# Altium project Standard 60.PrjPcb
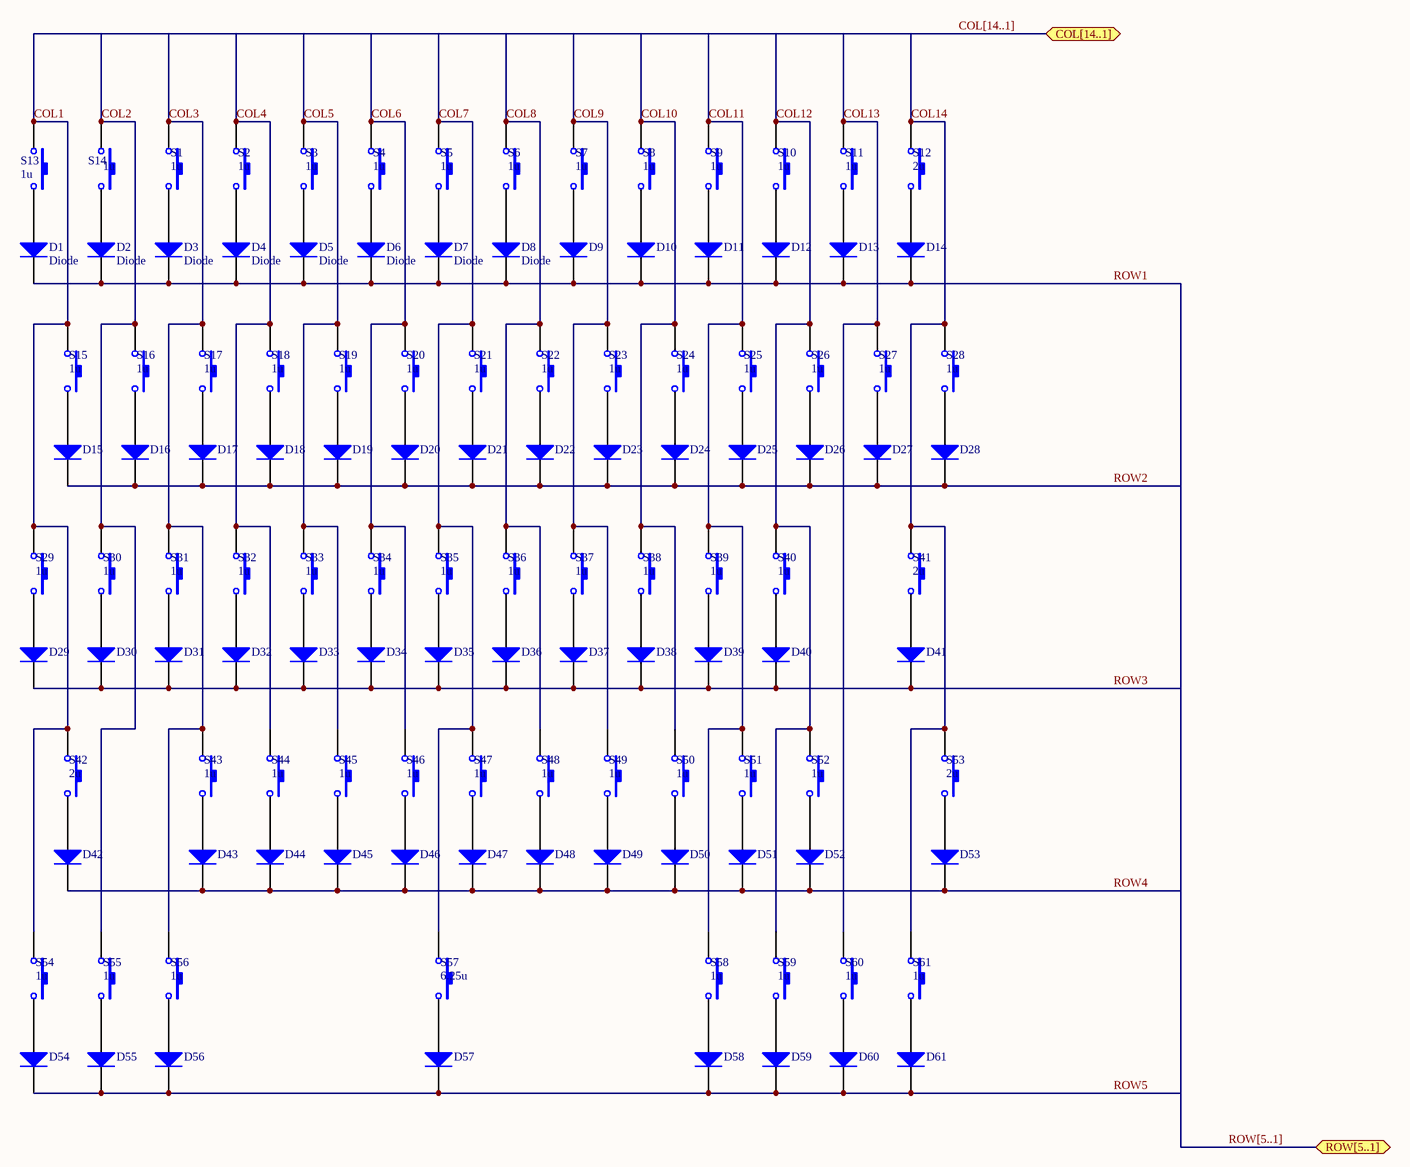
[diagram p0: matrix.SchDoc]
2 sheets, 138 parts. Net scope: flat (ports and power ports of the same name join across sheets).
Board files: Standard 60 03.PcbDoc, Standard 60.PcbDoc, Standard 60 02.PcbDoc
Sheets:
  matrix.SchDoc
  MCU.SchDoc

## Sheet matrix.SchDoc
size A3; SheetNumber: 1; SheetTotal: 2

### Parts
D1  Diode  [SOD-323f]
D2  Diode  [SOD-323f]
D3  Diode  [SOD-323f]
D4  Diode  [SOD-323f]
D5  Diode  [SOD-323f]
D6  Diode  [SOD-323f]
D7  Diode  [SOD-323f]
D8  Diode  [SOD-323f]
D9  Diode  [SOD-323f]  (value not drawn)
D10  Diode  [SOD-323f]  (value not drawn)
D11  Diode  [SOD-323f]  (value not drawn)
D12  Diode  [SOD-323f]  (value not drawn)
D13  Diode  [SOD-323f]  (value not drawn)
D14  Diode  [SOD-323f]  (value not drawn)
D15  Diode  [SOD-323f]  (value not drawn)
D16  Diode  [SOD-323f]  (value not drawn)
D17  Diode  [SOD-323f]  (value not drawn)
D18  Diode  [SOD-323f]  (value not drawn)
D19  Diode  [SOD-323f]  (value not drawn)
D20  Diode  [SOD-323f]  (value not drawn)
D21  Diode  [SOD-323f]  (value not drawn)
D22  Diode  [SOD-323f]  (value not drawn)
D23  Diode  [SOD-323f]  (value not drawn)
D24  Diode  [SOD-323f]  (value not drawn)
D25  Diode  [SOD-323f]  (value not drawn)
D26  Diode  [SOD-323f]  (value not drawn)
D27  Diode  [SOD-323f]  (value not drawn)
D28  Diode  [SOD-323f]  (value not drawn)
D29  Diode  [SOD-323f]  (value not drawn)
D30  Diode  [SOD-323f]  (value not drawn)
D31  Diode  [SOD-323f]  (value not drawn)
D32  Diode  [SOD-323f]  (value not drawn)
D33  Diode  [SOD-323f]  (value not drawn)
D34  Diode  [SOD-323f]  (value not drawn)
D35  Diode  [SOD-323f]  (value not drawn)
D36  Diode  [SOD-323f]  (value not drawn)
D37  Diode  [SOD-323f]  (value not drawn)
D38  Diode  [SOD-323f]  (value not drawn)
D39  Diode  [SOD-323f]  (value not drawn)
D40  Diode  [SOD-323f]  (value not drawn)
D41  Diode  [SOD-323f]  (value not drawn)
D42  Diode  [SOD-323f]  (value not drawn)
D43  Diode  [SOD-323f]  (value not drawn)
D44  Diode  [SOD-323f]  (value not drawn)
D45  Diode  [SOD-323f]  (value not drawn)
D46  Diode  [SOD-323f]  (value not drawn)
D47  Diode  [SOD-323f]  (value not drawn)
D48  Diode  [SOD-323f]  (value not drawn)
D49  Diode  [SOD-323f]  (value not drawn)
D50  Diode  [SOD-323f]  (value not drawn)
D51  Diode  [SOD-323f]  (value not drawn)
D52  Diode  [SOD-323f]  (value not drawn)
D53  Diode  [SOD-323f]  (value not drawn)
D54  Diode  [SOD-323f]  (value not drawn)
D55  Diode  [SOD-323f]  (value not drawn)
D56  Diode  [SOD-323f]  (value not drawn)
D57  Diode  [SOD-323f]  (value not drawn)
D58  Diode  [SOD-323f]  (value not drawn)
D59  Diode  [SOD-323f]  (value not drawn)
D60  Diode  [SOD-323f]  (value not drawn)
D61  Diode  [SOD-323f]  (value not drawn)
S1  1u  [mx1u]
S2  1u  [mx1u]
S3  1u  [mx1u]
S4  1u  [mx1u]
S5  1u  [mx1u]
S6  1u  [mx1u]
S7  1u  [mx1u]
S8  1u  [mx1u]
S9  1u  [mx1u]
S10  1u  [mx1u]
S11  1u  [mx1u]
S12  2u  [mx2u]
S13  1u  [mx1u]
S14  1u  [mx1u]
S15  1u  [mx1u]
S16  1u  [mx1u]
S17  1u  [mx1u]
S18  1u  [mx1u]
S19  1u  [mx1u]
S20  1u  [mx1u]
S21  1u  [mx1u]
S22  1u  [mx1u]
S23  1u  [mx1u]
S24  1u  [mx1u]
S25  1u  [mx1u]
S26  1u  [mx1u]
S27  1u  [mx1u]
S28  1u  [mx1u]
S29  1u  [mx1u]
S30  1u  [mx1u]
S31  1u  [mx1u]
S32  1u  [mx1u]
S33  1u  [mx1u]
S34  1u  [mx1u]
S35  1u  [mx1u]
S36  1u  [mx1u]
S37  1u  [mx1u]
S38  1u  [mx1u]
S39  1u  [mx1u]
S40  1u  [mx1u]
S41  2u  [mx2u]
S42  2u  [mx2u]
S43  1u  [mx1u]
S44  1u  [mx1u]
S45  1u  [mx1u]
S46  1u  [mx1u]
S47  1u  [mx1u]
S48  1u  [mx1u]
S49  1u  [mx1u]
S50  1u  [mx1u]
S51  1u  [mx1u]
S52  1u  [mx1u]
S53  2u  [mx2u]
S54  1u  [mx1u]
S55  1u  [mx1u]
S56  1u  [mx1u]
S57  6.25u  [mx6.25u flipped stab]
S58  1u  [mx1u]
S59  1u  [mx1u]
S60  1u  [mx1u]
S61  1u  [mx1u]

### Ports
COL[14..1] (bidir), ROW[5..1] (bidir)

### Nets
COL1: S13.1 S15.1 S29.1 S42.1 S54.1
COL2: S14.1 S16.1 S30.1 S55.1
COL3: S1.1 S17.1 S31.1 S43.1 S56.1
COL4: S2.1 S18.1 S32.1 S44.1
COL5: S3.1 S19.1 S33.1 S45.1
COL6: S4.1 S20.1 S34.1 S46.1
COL7: S5.1 S21.1 S35.1 S47.1 S57.1
COL8: S6.1 S22.1 S36.1 S48.1
COL9: S7.1 S23.1 S37.1 S49.1
COL10: S8.1 S24.1 S38.1 S50.1
COL11: S9.1 S25.1 S39.1 S51.1 S58.1
COL12: S10.1 S26.1 S40.1 S52.1 S59.1
COL13: S11.1 S27.1 S60.1
COL14: S12.1 S28.1 S41.1 S53.1 S61.1
ROW1: D1.1(K) D2.1(K) D3.1(K) D4.1(K) D5.1(K) D6.1(K) D7.1(K) D8.1(K) D9.1(K) D10.1(K) D11.1(K) D12.1(K) D13.1(K) D14.1(K)
ROW2: D15.1(K) D16.1(K) D17.1(K) D18.1(K) D19.1(K) D20.1(K) D21.1(K) D22.1(K) D23.1(K) D24.1(K) D25.1(K) D26.1(K) D27.1(K) D28.1(K)
ROW3: D29.1(K) D30.1(K) D31.1(K) D32.1(K) D33.1(K) D34.1(K) D35.1(K) D36.1(K) D37.1(K) D38.1(K) D39.1(K) D40.1(K) D41.1(K)
ROW4: D42.1(K) D43.1(K) D44.1(K) D45.1(K) D46.1(K) D47.1(K) D48.1(K) D49.1(K) D50.1(K) D51.1(K) D52.1(K) D53.1(K)
ROW5: D54.1(K) D55.1(K) D56.1(K) D57.1(K) D58.1(K) D59.1(K) D60.1(K) D61.1(K)
NetD1_2: D1.2(A) S13.2
NetD2_2: D2.2(A) S14.2
NetD3_2: D3.2(A) S1.2
NetD4_2: D4.2(A) S2.2
NetD5_2: D5.2(A) S3.2
NetD6_2: D6.2(A) S4.2
NetD7_2: D7.2(A) S5.2
NetD8_2: D8.2(A) S6.2
NetD9_2: D9.2(A) S7.2
NetD10_2: D10.2(A) S8.2
NetD11_2: D11.2(A) S9.2
NetD12_2: D12.2(A) S10.2
NetD13_2: D13.2(A) S11.2
NetD14_2: D14.2(A) S12.2
NetD15_2: D15.2(A) S15.2
NetD16_2: D16.2(A) S16.2
NetD17_2: D17.2(A) S17.2
NetD18_2: D18.2(A) S18.2
NetD19_2: D19.2(A) S19.2
NetD20_2: D20.2(A) S20.2
NetD21_2: D21.2(A) S21.2
NetD22_2: D22.2(A) S22.2
NetD23_2: D23.2(A) S23.2
NetD24_2: D24.2(A) S24.2
NetD25_2: D25.2(A) S25.2
NetD26_2: D26.2(A) S26.2
NetD27_2: D27.2(A) S27.2
NetD28_2: D28.2(A) S28.2
NetD29_2: D29.2(A) S29.2
NetD30_2: D30.2(A) S30.2
NetD31_2: D31.2(A) S31.2
NetD32_2: D32.2(A) S32.2
NetD33_2: D33.2(A) S33.2
NetD34_2: D34.2(A) S34.2
NetD35_2: D35.2(A) S35.2
NetD36_2: D36.2(A) S36.2
NetD37_2: D37.2(A) S37.2
NetD38_2: D38.2(A) S38.2
NetD39_2: D39.2(A) S39.2
NetD40_2: D40.2(A) S40.2
NetD41_2: D41.2(A) S41.2
NetD42_2: D42.2(A) S42.2
NetD43_2: D43.2(A) S43.2
NetD44_2: D44.2(A) S44.2
NetD45_2: D45.2(A) S45.2
NetD46_2: D46.2(A) S46.2
NetD47_2: D47.2(A) S47.2
NetD48_2: D48.2(A) S48.2
NetD49_2: D49.2(A) S49.2
NetD50_2: D50.2(A) S50.2
NetD51_2: D51.2(A) S51.2
NetD52_2: D52.2(A) S52.2
NetD53_2: D53.2(A) S53.2
NetD54_2: D54.2(A) S54.2
NetD55_2: D55.2(A) S55.2
NetD56_2: D56.2(A) S56.2
NetD57_2: D57.2(A) S57.2
NetD58_2: D58.2(A) S58.2
NetD59_2: D59.2(A) S59.2
NetD60_2: D60.2(A) S60.2
NetD61_2: D61.2(A) S61.2

### Buses and harness runs
bus COL[14..1] = port COL[14..1]
bus ROW[5..1] = port ROW[5..1]

### Library data of the parts
S1-S11 S13-S40 S43-S52 S54-S56 S58-S61 = 1u: 1-2u Mx Switch
S12 S41 S42 S53 = 2u: 2-3u Mx Switch with pcb mount stabs
S57 = 6.25u: 6.25u Mx Switch with pcb mount stabs

## Sheet MCU.SchDoc
size A4; SheetNumber: 2; SheetTotal: 2
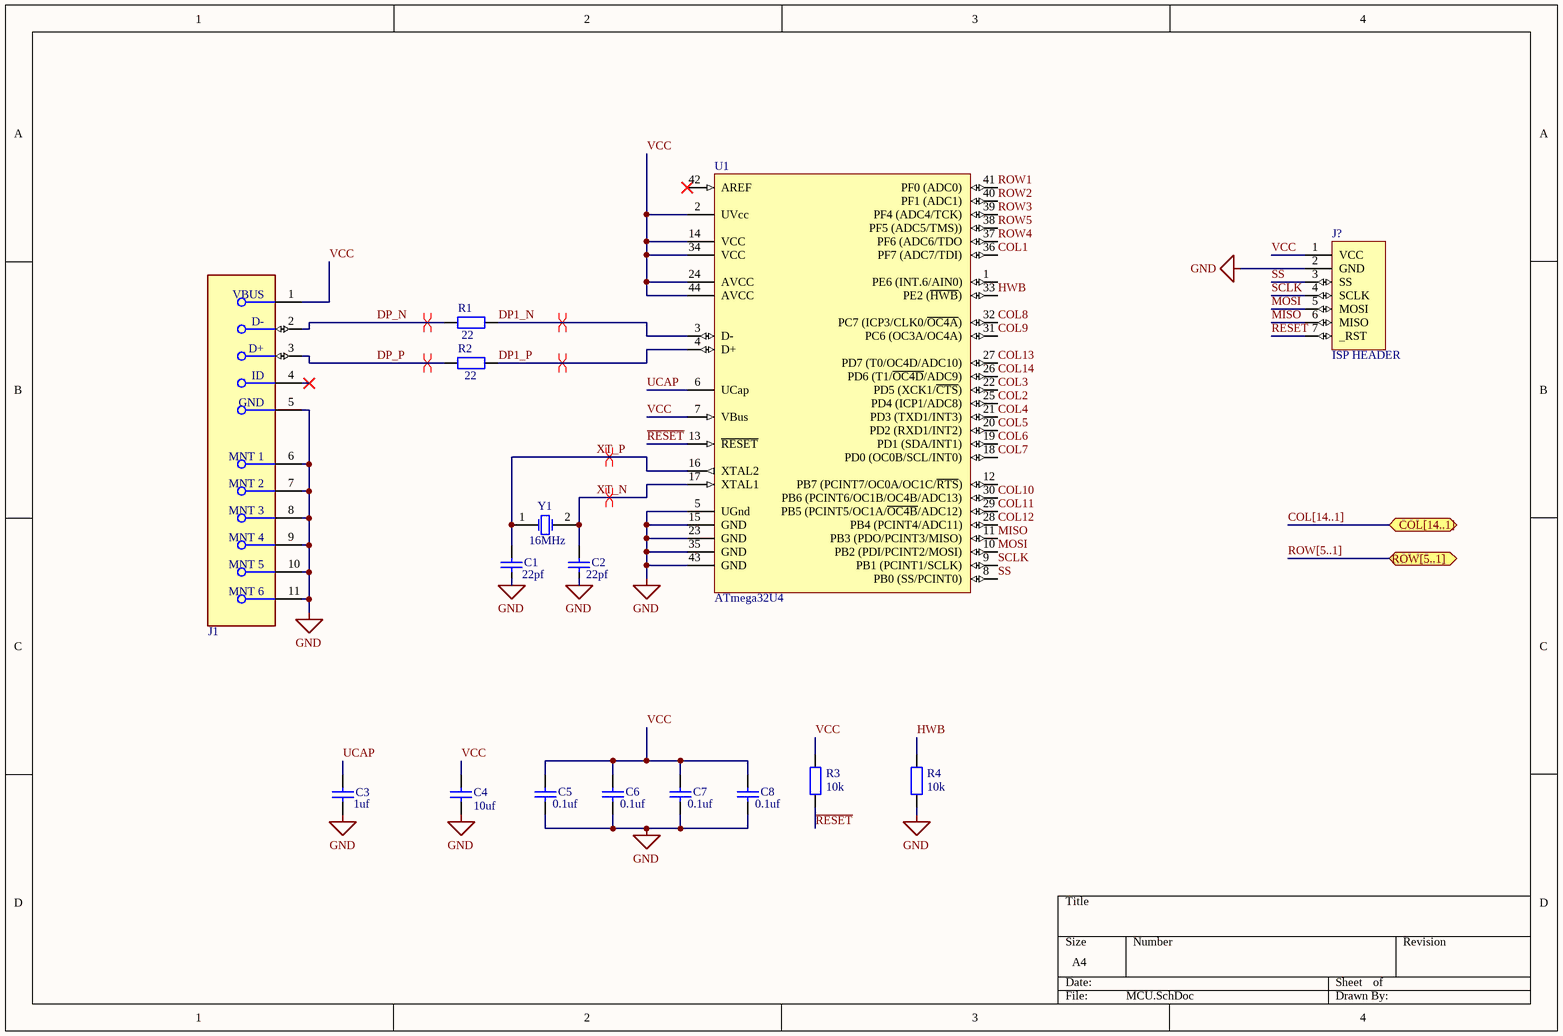
[diagram p1: MCU.SchDoc]

### Parts
C1  value 22pf  [0805]  (hidden comment: Cap)
C2  value 22pf  [0805]  (hidden comment: Cap)
C3  value 1uf  [0805]  (hidden comment: Cap)
C4  value 10uf  [0805]  (hidden comment: Cap)
C5  value 0.1uf  [0805]  (hidden comment: Cap)
C6  value 0.1uf  [0805]  (hidden comment: Cap)
C7  value 0.1uf  [0805]  (hidden comment: Cap)
C8  value 0.1uf  [0805]  (hidden comment: Cap)
J1  Molex 473460001  [Molex 47346 0001]  (value not drawn)
J?  ISP HEADER  [Spi header]
R1  value 22  [0805]  (hidden comment: Res)
R2  value 22  [0805]  (hidden comment: Res)
R3  value 10k  [0805]  (hidden comment: Res)
R4  value 10k  [0805]  (hidden comment: Res)
U1  ATmega32U4  [TQFP44]
Y1  value 16MHz  [ABM3]  (hidden comment: XTAL)

### Ports
COL[14..1] (bidir), ROW[5..1] (bidir)

### Nets
GND: C1.1 C2.1 C3.1 C4.1 C5.1 C6.1 C7.1 C8.1 J1.5(GND) J1.6(MNT_1) J1.7(MNT_2) J1.8(MNT_3) J1.9(MNT_4) J1.10(MNT_5) J1.11(MNT_6) J?.2(GND) R4.2 U1.5(UGnd) U1.15(GND) U1.23(GND) U1.35(GND) U1.43(GND)
~{RESET}: J?.7(_RST) R3.2 U1.13(~{RESET})
COL1: U1.36(PF7_(ADC7/TDI))
COL2: U1.25(PD4_(ICP1/ADC8))
COL3: U1.22(PD5_(XCK1/~{CTS}))
COL4: U1.21(PD3_(TXD1/INT3))
COL5: U1.20(PD2_(RXD1/INT2))
COL6: U1.19(PD1_(SDA/INT1))
COL7: U1.18(PD0_(OC0B/SCL/INT0))
COL8: U1.32(PC7_(ICP3/CLK0/~{OC4A}))
COL9: U1.31(PC6_(OC3A/OC4A))
COL10: U1.30(PB6_(PCINT6/OC1B/OC4B/ADC13))
COL11: U1.29(PB5_(PCINT5/OC1A/~{OC4B}/ADC12))
COL12: U1.28(PB4_(PCINT4/ADC11))
COL13: U1.27(PD7_(T0/OC4D/ADC10))
COL14: U1.26(PD6_(T1/~{OC4D}/ADC9))
DP1_N: R1.2 U1.3(D-)
DP1_P: R2.2 U1.4(D+)
DP_N: J1.2(D-) R1.1
DP_P: J1.3(D+) R2.1
HWB: R4.1 U1.33(PE2_(~{HWB}))
MISO: J?.6(MISO) U1.11(PB3_(PDO/PCINT3/MISO))
MOSI: J?.5(MOSI) U1.10(PB2_(PDI/PCINT2/MOSI))
ROW1: U1.41(PF0_(ADC0))
ROW2: U1.40(PF1_(ADC1))
ROW3: U1.39(PF4_(ADC4/TCK))
ROW4: U1.37(PF6_(ADC6/TDO)
ROW5: U1.38(PF5_(ADC5/TMS)))
SCLK: J?.4(SCLK) U1.9(PB1_(PCINT1/SCLK))
SS: J?.3(SS) U1.8(PB0_(SS/PCINT0))
UCAP: C3.2 U1.6(UCap)
VCC: C4.2 C5.2 C6.2 C7.2 C8.2 J1.1(VBUS) J?.1(VCC) R3.1 U1.2(UVcc) U1.7(VBus) U1.14(VCC) U1.24(AVCC) U1.34(VCC) U1.44(AVCC)
XT_N: C2.2 U1.17(XTAL1) Y1.2(OSC2)
XT_P: C1.2 U1.16(XTAL2) Y1.1(OSC1)

Not connected (* = marked no-connect by the designer): J1 4(ID)*; U1 1(PE6_(INT.6/AIN0)) 12(PB7_(PCINT7/OC0A/OC1C/~{RTS})) 42(AREF)*

### Buses and harness runs
bus COL[14..1] = port COL[14..1]
bus ROW[5..1] = port ROW[5..1]

### Layout directives
differential pair: DP1_N, DP1_P, DP_N, DP_P, XT_N, XT_P

### Library data of the parts
C1-C8 = Cap: Capacitor
J1 = Molex 473460001: Micro usb receptacle
R1-R4 = Res: Resistor
  R1: Published: 8-Jun-2000; LatestRevisionDate: 17-Jul-2002; LatestRevisionNote: Re-released for DXP Platform.; PackageReference: AXIAL-0.4; Publisher: Altium Limited; PackageDescription: Axial Device, Thru-Hole; 2 Leads; 0.4 in Pin Spacing
U1 = ATmega32U4: 8-bit AVR Microcontroller; Manufacturer: Microchip / Atmel; Manufacturer Part Number: ATMEGA32U4-AU; RevisionNote: DatasheetVersion updated. URLs added.; ComponentLink1Description: Manufacturer URL; PackageDescription: 44-Pin Plastic Thin Quad Flat Pack, 10 x 10 x 1.0 mm Body, 0.8 mm Pitch (TQFP); DatasheetVersion: revF, Nov-2010; ComponentLink2URL: http://www.atmel.com/dyn/resources/prod_documents/doc7766.pdf; ComponentLink1URL: http://www.atmel.com/; PackageReference: 44ML; ComponentLink2Description: ATmega16U4/32U4 Datasheet; PackageVersion: rev.G, Jul-2007; ComponentLink3URL: http://www.atmel.com/dyn/resources/prod_documents/7766S.pdf; ComponentLink3Description: ATmega16U4 ATmega32U4 Summary
Y1 = XTAL: Crystal Oscillator

## Nets that join several sheets
COL1: matrix (5 pins), MCU (U1.36)
COL2: matrix (S14.1 S16.1 S30.1 S55.1), MCU (U1.25)
COL3: matrix (5 pins), MCU (U1.22)
COL4: matrix (S2.1 S18.1 S32.1 S44.1), MCU (U1.21)
COL5: matrix (S3.1 S19.1 S33.1 S45.1), MCU (U1.20)
COL6: matrix (S4.1 S20.1 S34.1 S46.1), MCU (U1.19)
COL7: matrix (5 pins), MCU (U1.18)
COL8: matrix (S6.1 S22.1 S36.1 S48.1), MCU (U1.32)
COL9: matrix (S7.1 S23.1 S37.1 S49.1), MCU (U1.31)
COL10: matrix (S8.1 S24.1 S38.1 S50.1), MCU (U1.30)
COL11: matrix (5 pins), MCU (U1.29)
COL12: matrix (5 pins), MCU (U1.28)
COL13: matrix (S11.1 S27.1 S60.1), MCU (U1.27)
COL14: matrix (5 pins), MCU (U1.26)
ROW1: matrix (14 pins), MCU (U1.41)
ROW2: matrix (14 pins), MCU (U1.40)
ROW3: matrix (13 pins), MCU (U1.39)
ROW4: matrix (12 pins), MCU (U1.37)
ROW5: matrix (8 pins), MCU (U1.38)